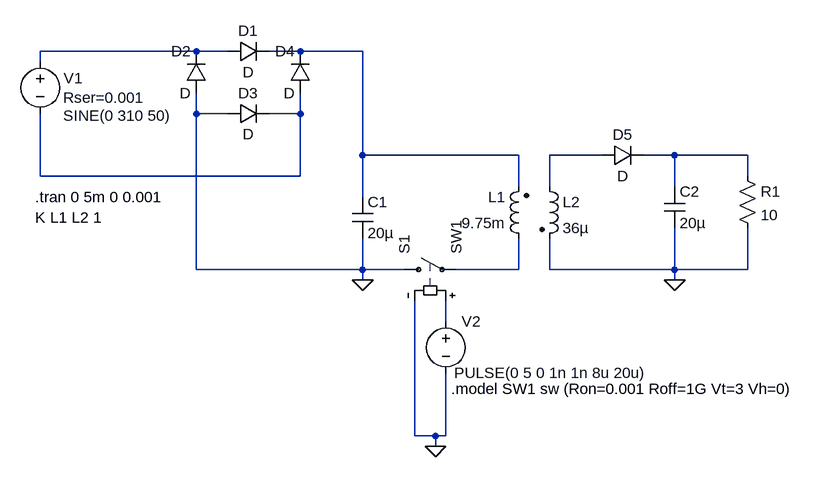
[diagram p0: schematic 2.asc]
2.asc, the LTspice schematic file:
Version 4
SHEET 1 1416 724
WIRE 304 96 64 96
WIRE 352 96 304 96
WIRE 464 96 416 96
WIRE 560 96 464 96
WIRE 64 112 64 96
WIRE 304 192 304 160
WIRE 352 192 304 192
WIRE 464 192 464 160
WIRE 464 192 416 192
WIRE 560 256 560 96
WIRE 800 256 560 256
WIRE 928 256 848 256
WIRE 1040 256 992 256
WIRE 1152 256 1040 256
WIRE 64 288 64 192
WIRE 464 288 464 192
WIRE 464 288 64 288
WIRE 1152 288 1152 256
WIRE 800 304 800 256
WIRE 848 304 848 256
WIRE 1040 304 1040 256
WIRE 560 320 560 256
WIRE 304 432 304 192
WIRE 560 432 560 384
WIRE 560 432 304 432
WIRE 624 432 560 432
WIRE 800 432 800 384
WIRE 800 432 704 432
WIRE 848 432 848 384
WIRE 1040 432 1040 368
WIRE 1040 432 848 432
WIRE 1152 432 1152 368
WIRE 1152 432 1040 432
WIRE 560 448 560 432
WIRE 1040 448 1040 432
WIRE 688 512 688 480
WIRE 640 688 640 480
WIRE 672 688 640 688
WIRE 688 688 688 592
WIRE 688 688 672 688
WIRE 672 704 672 688
FLAG 672 704 0
FLAG 1040 448 0
FLAG 560 448 0
SYMBOL voltage 64 96 R0
WINDOW 3 35 99 Left 2
WINDOW 123 0 0 Left 2
WINDOW 39 35 71 Left 2
WINDOW 0 36 41 Left 2
SYMATTR Value SINE(0 310 50)
SYMATTR SpiceLine Rser=0.001
SYMATTR InstName V1
SYMBOL diode 352 112 R270
WINDOW 0 32 32 VTop 2
WINDOW 3 0 32 VBottom 2
SYMATTR InstName D1
SYMBOL diode 320 160 R180
WINDOW 0 24 64 Left 2
WINDOW 3 24 0 Left 2
SYMATTR InstName D2
SYMBOL diode 352 208 R270
WINDOW 0 32 32 VTop 2
WINDOW 3 0 32 VBottom 2
SYMATTR InstName D3
SYMBOL diode 480 160 R180
WINDOW 0 24 64 Left 2
WINDOW 3 24 0 Left 2
SYMATTR InstName D4
SYMBOL ind2 816 400 R180
WINDOW 0 36 80 Left 2
WINDOW 3 36 40 Left 2
SYMATTR InstName L1
SYMATTR Value 9.75m
SYMATTR Type ind
SYMBOL sw 608 432 R270
SYMATTR InstName S1
SYMATTR Value SW1
SYMBOL cap 544 320 R0
SYMATTR InstName C1
SYMATTR Value 20µ
SYMBOL voltage 688 496 R0
WINDOW 3 13 95 Left 2
WINDOW 123 0 0 Left 2
WINDOW 39 24 44 Left 2
SYMATTR Value PULSE(0 5 0 1n 1n 8u 20u)
SYMATTR InstName V2
SYMBOL ind2 832 288 R0
SYMATTR InstName L2
SYMATTR Value 36µ
SYMATTR Type ind
SYMBOL diode 928 272 R270
WINDOW 0 32 32 VTop 2
WINDOW 3 0 32 VBottom 2
SYMATTR InstName D5
SYMBOL cap 1024 304 R0
SYMATTR InstName C2
SYMATTR Value 20µ
SYMBOL res 1136 272 R0
SYMATTR InstName R1
SYMATTR Value 10
TEXT 56 352 Left 2 !K L1 L2 1
TEXT 56 320 Left 2 !.tran 0 5m 0 0.001
TEXT 696 616 Left 2 !.model SW1 sw (Ron=0.001 Roff=1G Vt=3 Vh=0)

The netlist it stands for:
* 2.asc
V1 N001 N003 SINE(0 310 50) Rser=0.001
D1 N001 N002 D
D2 0 N001 D
D3 0 N003 D
D4 N003 N002 D
L1 N006 N002 9.75m
S1 0 N006 N007 0 SW1
C1 N002 0 20µ
V2 N007 0 PULSE(0 5 0 1n 1n 8u 20u)
L2 N004 0 36µ
D5 N004 N005 D
C2 N005 0 20µ
R1 N005 0 10
.model D D
.lib standard.dio
K L1 L2 1
.tran 0 5m 0 0.001
.model SW1 sw (Ron=0.001 Roff=1G Vt=3 Vh=0)
.backanno
.end